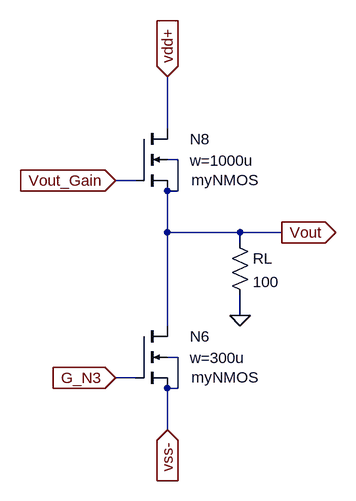
[diagram p0: schematic Buffer_Amplifier.asc]
Buffer_Amplifier.asc, the LTspice schematic file:
Version 4
SHEET 1 880 680
WIRE 160 -128 160 -208
WIRE 176 -80 160 -80
WIRE 112 -48 80 -48
WIRE 176 -32 176 -80
WIRE 176 -32 160 -32
WIRE 160 32 160 -32
WIRE 272 32 160 32
WIRE 336 32 272 32
WIRE 272 48 272 32
WIRE 272 160 272 128
WIRE 160 176 160 32
WIRE 176 224 160 224
WIRE 112 256 80 256
WIRE 176 272 176 224
WIRE 176 272 160 272
WIRE 160 336 160 272
FLAG 160 -208 vdd+
IOPIN 160 -208 In
FLAG 336 32 Vout
IOPIN 336 32 Out
FLAG 272 160 0
FLAG 80 -48 Vout_Gain
IOPIN 80 -48 In
FLAG 80 256 G_N3
IOPIN 80 256 In
FLAG 160 336 vss-
IOPIN 160 336 In
SYMBOL nmos4 112 -128 R0
WINDOW 3 85 79 Left 2
WINDOW 0 83 16 Left 2
WINDOW 123 83 49 Left 2
SYMATTR Value myNMOS
SYMATTR InstName N8
SYMATTR Value2 w=1000u
SYMBOL res 256 32 R0
SYMATTR InstName RL
SYMATTR Value 100
SYMBOL nmos4 112 176 R0
WINDOW 3 85 79 Left 2
WINDOW 0 83 16 Left 2
WINDOW 123 83 49 Left 2
SYMATTR Value myNMOS
SYMATTR InstName N6
SYMATTR Value2 w=300u

The netlist it stands for:
* Buffer_Amplifier.asc
M§N8 vdd+ Vout_Gain Vout Vout myNMOS w=1000u
RL Vout 0 100
M§N6 Vout G_N3 vss- vss- myNMOS w=300u
.model NMOS NMOS
.model PMOS PMOS
.lib standard.mos
.backanno
.end